# Altium schematic sheet PowerModule_Schematic.SchDoc
size A4
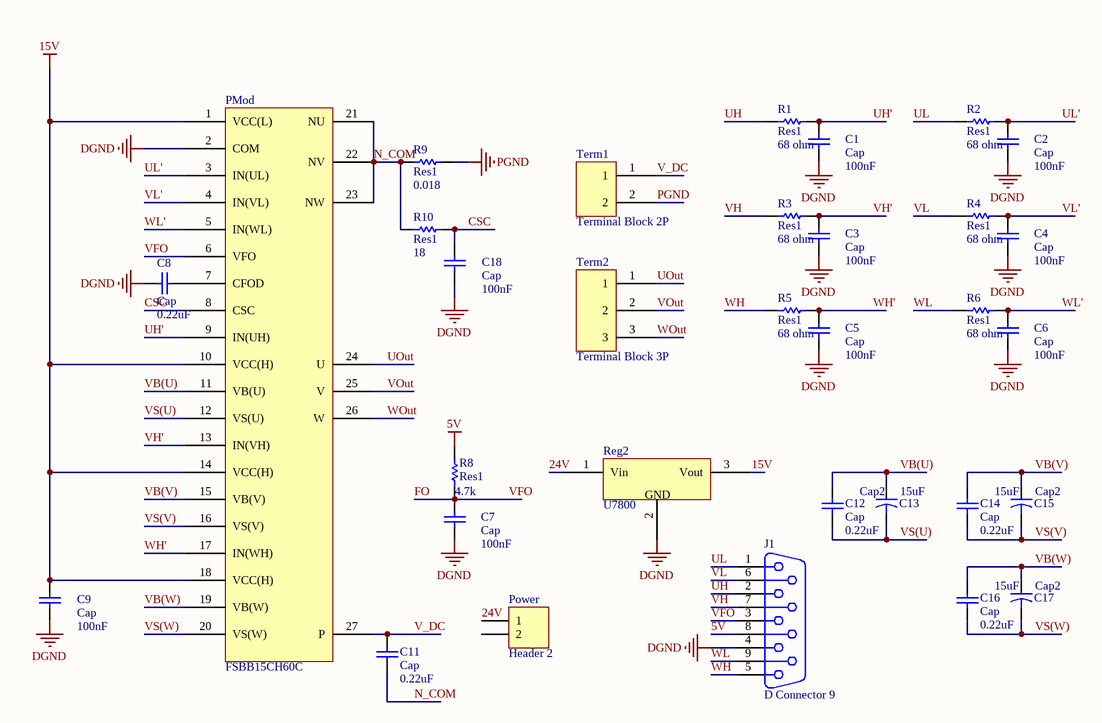
[diagram p0: PowerModule_Schematic.SchDoc]

## Parts
C1  Cap  value 100nF  [NPolar_Cap]
C2  Cap  value 100nF  [NPolar_Cap]
C3  Cap  value 100nF  [NPolar_Cap]
C4  Cap  value 100nF  [NPolar_Cap]
C5  Cap  value 100nF  [NPolar_Cap]
C6  Cap  value 100nF  [NPolar_Cap]
C7  Cap  value 100nF  [NPolar_Cap]
C8  Cap  value 0.22uF  [NPolar_Cap]
C9  Cap  value 100nF  [NPolar_Cap]
C11  Cap  value 0.22uF  [NPolar_Cap]
C12  Cap  value 0.22uF  [NPolar_Cap]
C13  Cap2  value 15uF  [Polar_Cap]
C14  Cap  value 0.22uF  [NPolar_Cap]
C15  Cap2  value 15uF  [Polar_Cap]
C16  Cap  value 0.22uF  [NPolar_Cap]
C17  Cap2  value 15uF  [Polar_Cap]
C18  Cap  value 100nF  [NPolar_Cap]
J1  D Connector 9  [DSUB1.385-2H9]
PMod  FSBB15CH60C  [FSBB20CH60F]
Power  Header 2  [HDR1X2]
R1  Res1  value 68 ohm  [AXIAL-0.3]
R2  Res1  value 68 ohm  [AXIAL-0.3]
R3  Res1  value 68 ohm  [AXIAL-0.3]
R4  Res1  value 68 ohm  [AXIAL-0.3]
R5  Res1  value 68 ohm  [AXIAL-0.3]
R6  Res1  value 68 ohm  [AXIAL-0.3]
R8  Res1  value 4.7k  [AXIAL-0.3]
R9  Res1  value 0.018  [AXIAL-0.3]
R10  Res1  value 18  [AXIAL-0.3]
Reg2  U7800  [U7800]
Term1  Terminal Block 2P  [Terminal Block 2 Pin]
Term2  Terminal Block 3P  [Terminal Block 3 Pin]

## Nets
5V: J1.8 R8.2
15V: C9.2 PMod.1(VCC(L)) PMod.10(VCC(H)) PMod.14(VCC(H)) PMod.18(VCC(H)) Reg2.3(Vout)
DGND: C1.1 C2.1 C3.1 C4.1 C5.1 C6.1 C7.1 C8.1 C9.1 C18.1 J1.4 PMod.2(COM) Reg2.2(GND)
PGND: R9.1 Term1.2
24V: Power.1 Reg2.1(Vin)
CSC: C18.2 PMod.8(CSC) R10.1
FO: C7.2 J1.3 PMod.6(VFO) R8.1  [also labelled VFO]
N_COM: C11.1 PMod.21(NU) PMod.22(NV) PMod.23(NW) R9.2 R10.2
UH: J1.2 R1.1
UH': C1.2 PMod.9(IN(UH)) R1.2
UL: J1.1 R2.1
UL': C2.2 PMod.3(IN(UL)) R2.2
UOut: PMod.24(U) Term2.1
V_DC: C11.2 PMod.27(P) Term1.1
VB(U): C12.2 C13.1 PMod.11(VB(U))
VB(V): C14.2 C15.1 PMod.15(VB(V))
VB(W): C16.2 C17.1 PMod.19(VB(W))
VH: J1.7 R3.1
VH': C3.2 PMod.13(IN(VH)) R3.2
VL: J1.6 R4.1
VL': C4.2 PMod.4(IN(VL)) R4.2
VOut: PMod.25(V) Term2.2
VS(U): C12.1 C13.2 PMod.12(VS(U))
VS(V): C14.1 C15.2 PMod.16(VS(V))
VS(W): C16.1 C17.2 PMod.20(VS(W))
WH: J1.5 R5.1
WH': C5.2 PMod.17(IN(WH)) R5.2
WL: J1.9 R6.1
WL': C6.2 PMod.5(IN(WL)) R6.2
WOut: PMod.26(W) Term2.3
NetC8_2: C8.2 PMod.7(CFOD)

Not connected (* = marked no-connect by the designer): Power 2

## Library data of the parts
C1-C9 C11 C12 C14 C16 C18 = Cap: Capacitor; Published: 8-Jun-2000; LatestRevisionDate: 17-Jul-2002; LatestRevisionNote: Re-released for DXP Platform.; PackageReference: RAD-0.3; Publisher: Altium Limited
C13 C15 C17 = Cap2: Capacitor; Published: 23-Sep-2002; PackageReference: CAPR5-4X5; Publisher: Altium Limited
J1 = D Connector 9: Receptacle Assembly, 9 Position, Right Angle; PackageDocument: O; Positions: 9; Published: 15-Jun-2001; LatestRevisionDate: 17-Jul-2002; LatestRevisionNote: Re-released for DXP Platform.; DatasheetDocument: 1-Sep-1999; PackageReference: 788750; Publisher: Altium Limited; Orientation: Right Angle; Gender: Receptacle
Power = Header 2: Header, 2-Pin; LatestRevisionDate: 17-Jul-2002; LatestRevisionNote: Re-released for DXP Platform.; Publisher: Altium Limited
R1-R6 R8-R10 = Res1: Resistor; Published: 8-Jun-2000; LatestRevisionDate: 17-Jul-2002; LatestRevisionNote: Re-released for DXP Platform.; PackageReference: AXIAL-0.3; Publisher: Altium Limited